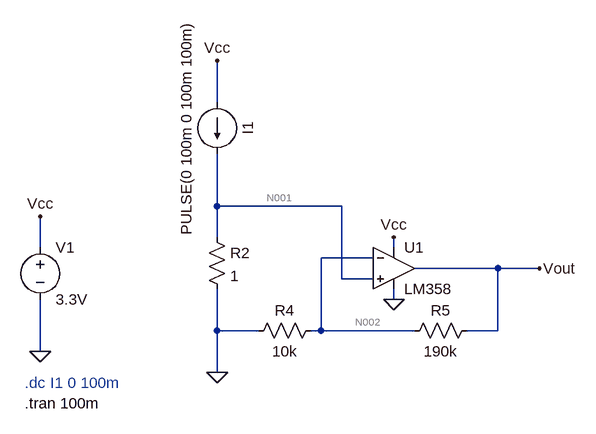
[diagram p0: schematic Draft1.asc]
Draft1.asc, the LTspice schematic file:
Version 4
SHEET 1 880 680
WIRE 112 -112 112 -176
WIRE 112 48 112 -32
WIRE 304 48 112 48
WIRE 112 96 112 48
WIRE -160 112 -160 64
WIRE 384 112 384 96
WIRE 352 128 272 128
WIRE 544 144 416 144
WIRE 608 144 544 144
WIRE 304 160 304 48
WIRE 352 160 304 160
WIRE 384 192 384 176
WIRE 112 240 112 176
WIRE 176 240 112 240
WIRE 272 240 272 128
WIRE 272 240 256 240
WIRE 416 240 272 240
WIRE 544 240 544 144
WIRE 544 240 496 240
WIRE -160 272 -160 192
WIRE 112 304 112 240
FLAG -160 272 0
FLAG -160 64 Vcc
FLAG 112 304 0
FLAG 384 192 0
FLAG 384 96 Vcc
FLAG 608 144 Vout
FLAG 112 -176 Vcc
SYMBOL voltage -160 96 R0
WINDOW 123 0 0 Left 0
WINDOW 39 0 0 Left 0
SYMATTR InstName V1
SYMATTR Value 3.3V
SYMBOL res 96 80 R0
SYMATTR InstName R2
SYMATTR Value 1
SYMBOL res 272 224 R90
WINDOW 0 0 56 VBottom 2
WINDOW 3 32 56 VTop 2
SYMATTR InstName R4
SYMATTR Value 10k
SYMBOL res 512 224 R90
WINDOW 0 0 56 VBottom 2
WINDOW 3 32 56 VTop 2
SYMATTR InstName R5
SYMATTR Value 190k
SYMBOL current 112 -112 R0
WINDOW 0 32 40 VTop 2
WINDOW 3 -32 40 VBottom 2
WINDOW 123 0 0 Left 0
WINDOW 39 0 0 Left 0
SYMATTR InstName I1
SYMATTR Value PULSE(0 100m 0 100m 100m)
SYMBOL ZZZ\\OpAmp\\LM358 384 144 R0
SYMATTR InstName U1
TEXT -184 320 Left 2 ;.dc I1 0 100m
TEXT -184 352 Left 2 !.tran 100m

The netlist it stands for:
* Draft1.asc
V1 Vcc 0 3.3V
R2 N001 0 1
R4 N002 0 10k
R5 Vout N002 190k
I1 Vcc N001 PULSE(0 100m 0 100m 100m)
XU1 N001 N002 Vcc 0 Vout LM358  ; pins In+ In- V+ V- OUT
* .dc I1 0 100m
.tran 100m
.backanno
.end

* Results of the author's LTspice run, read from the files saved beside the schematic
* Operating Point, zero values left out:
*   V(vcc) = 3.3 V
*   V(n001) = 9.806 nV
*   V(n002) = 885.1 µV
*   V(vout) = 15.78 mV
*   I(R2) = 9.806 nA
*   I(R4) = 88.51 nA
*   I(R5) = 78.38 nA
*   I(V1) = -673.7 µA
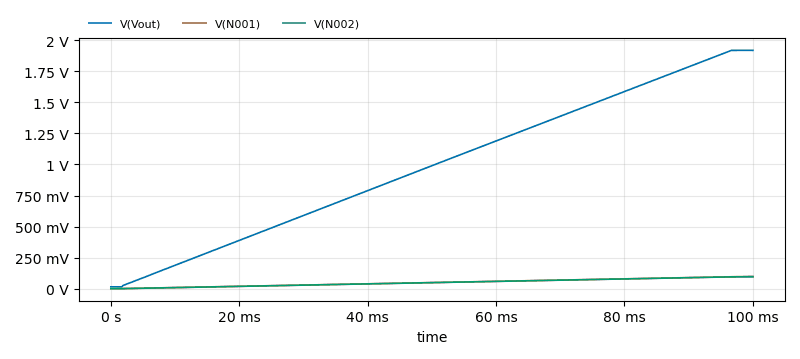
[diagram p1: Transient Analysis of Draft1.asc, plotted from the saved traces]
* Transient Analysis, 1 run:
*   V(Vout): min 15.78 mV, max 1.917 V, average 986.8 mV, rms 1.19 V, last 1.917 V
*   V(N001): min 0 V, max 100 mV, average 50 mV, rms 60.16 mV, last 100 mV
*   V(N002): min 885.1 µV, max 95.95 mV, average 49.44 mV, rms 59.59 mV, last 95.95 mV